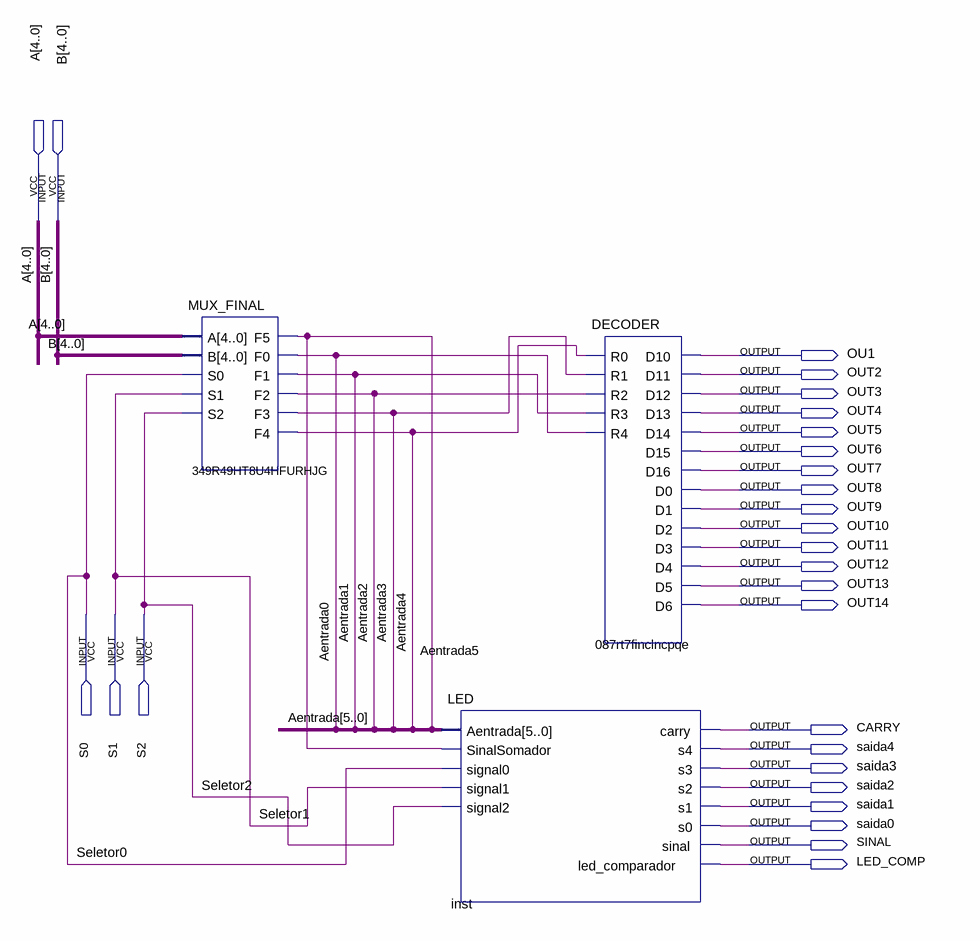
[diagram p0: schematic sheet]
// Quartus schematic ULA.bdf as structural Verilog: 3 symbols, 27 pins
module ULA (
  input  [4:0] A,
  input  [4:0] B,
  input  S0,
  input  S1,
  input  S2,
  output OU1,
  output OUT2,
  output OUT3,
  output OUT4,
  output OUT5,
  output OUT6,
  output OUT7,
  output OUT8,
  output OUT9,
  output OUT10,
  output OUT11,
  output OUT12,
  output OUT13,
  output OUT14,
  output CARRY,
  output saida4,
  output saida3,
  output saida2,
  output saida1,
  output saida0,
  output SINAL,
  output LED_COMP
);

  wire [5:0] Aentrada;

  MUX_FINAL u_349R49HT8U4HFURHJG (
    .A(A), .B(B), .S0(S0), .S1(S1), .S2(S2), .F5(Aentrada[5]), .F0(Aentrada[0]), .F1(Aentrada[1]),
    .F2(Aentrada[2]), .F3(Aentrada[3]), .F4(Aentrada[4]));
  LED inst (
    .Aentrada(Aentrada), .SinalSomador(Aentrada[5]), .signal0(S0), .signal1(S1), .signal2(S2), .carry(CARRY),
    .s4(saida4), .s3(saida3), .s2(saida2), .s1(saida1), .s0(saida0), .sinal(SINAL), .led_comparador(LED_COMP));
  DECODER u_087rt7finclncpqe (
    .R0(Aentrada[4]), .R1(Aentrada[3]), .R2(Aentrada[2]), .R3(Aentrada[1]), .R4(Aentrada[0]), .D10(OU1),
    .D11(OUT2), .D12(OUT3), .D13(OUT4), .D14(OUT5), .D15(OUT6), .D16(OUT7), .D0(OUT8), .D1(OUT9), .D2(OUT10),
    .D3(OUT11), .D4(OUT12), .D5(OUT13), .D6(OUT14));

  // Other names for the same wires on the sheet: Seletor0 = S0; Seletor1 = S1; Seletor2 = S2
endmodule
